# EAGLE design Flat Back Eurorack Busboard (EAGLE 7.2.0)
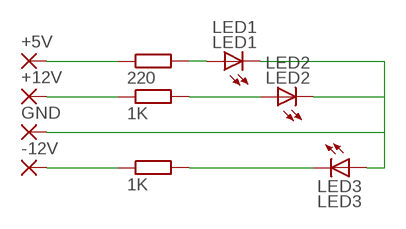
[diagram p0: schematic, sheet 1]

## Parts
+5V  SMD5  [SMD2,54-5,08]
+12V  SMD5  [SMD2,54-5,08]
-12V  SMD5  [SMD2,54-5,08]
GND  SMD5  [SMD2,54-5,08]
LED1  LED1  LEDCHIPLED_0805  [CHIPLED_0805]
LED2  LED2  LEDCHIPLED_0805  [CHIPLED_0805]
LED3  LED3  LEDCHIPLED_0805  [CHIPLED_0805]
R1  220  R-EU_M0805  [M0805]
R2  1K  R-EU_M0805  [M0805]
R3  1K  R-EU_M0805  [M0805]

## Nets
+5V: +5V.1(P) R1.1
+12V: +12V.1(P) R2.1
-12V: -12V.1(P) R3.1
GND: GND.1(P) LED1.C LED2.C LED3.A
N$13: LED1.A R1.2
N$14: LED2.A R2.2
N$15: LED3.C R3.2

## Library data of the parts
+5V +12V -12V GND = wirepad:SMD5: SMD PAD
LED1-LED3 = adafruit:LED: LED OSRAM: - CHIPLED LG R971, LG N971, LY N971, LG Q971, LY Q971, LO R971, LY R971 LH N974, LH R974 LS Q976, LO Q976, LY Q976 LO Q996 - Hyper CHIPLED LW Q18S LB Q993, LB Q99A, LB R99A - SideLED LS A670, LO A670, LY A670, LG A670, LP A670 LB A673, LV A673, LT A673, LW A673 LH A674 LY A675 LS A676, LA A676, LO A676, LY A676, LW A676 LS A679, LY A679, LG A679 - Hyper Micro SIDELED® LS Y876, LA Y876, LO Y876, LY Y876 LT Y87S - SmartLED LW L88C, LW L88S LB L89C, LB L89S, LG L890 LS L89K, LO L89K, LY L89K LS L896, LA L896, LO L896, LY L896 - TOPLED LS T670, LO T670, LY T670, LG T670, LP T670 LSG T670, LSP T670, LSY T670, LOP T670, LYG T670 LG T671, LOG T671, LSG T671 LB T673, LV T673, LT T673, LW T673 LH T674 LS T676, LA T676, LO T676, LY T676, LB T676, LH T676, LSB T676, LW T676 LB T67C, LV T67C, LT T67C, LS T67K, LO T67K, LY T67K, LW E67C LS E67B, LA E67B, LO E67B, LY E67B, LB E67C, LV E67C, LT E67C LW T67C LS T679, LY T679, LG T679 LS T770, LO T770, LY T770, LG T770, LP T770 LB T773, LV T773, LT T773, LW T773 LH T774 LS E675, LA E675, LY E675, LS T675 LS T776, LA T776, LO T776, LY T776, LB T776 LHGB T686 LT T68C, LB T68C - Hyper Mini TOPLED® LB M676 - Mini TOPLED Santana® LG M470 LS M47K, LO M47K, LY M47K Source: http://www.osram.convergy.de/
R1-R3 = resistor:R-EU_: RESISTOR, European symbol

## Board
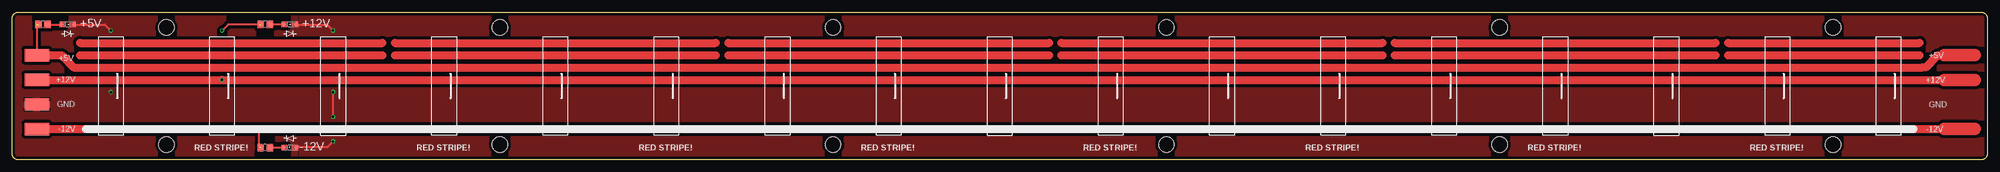
[diagram p1: board, top side]
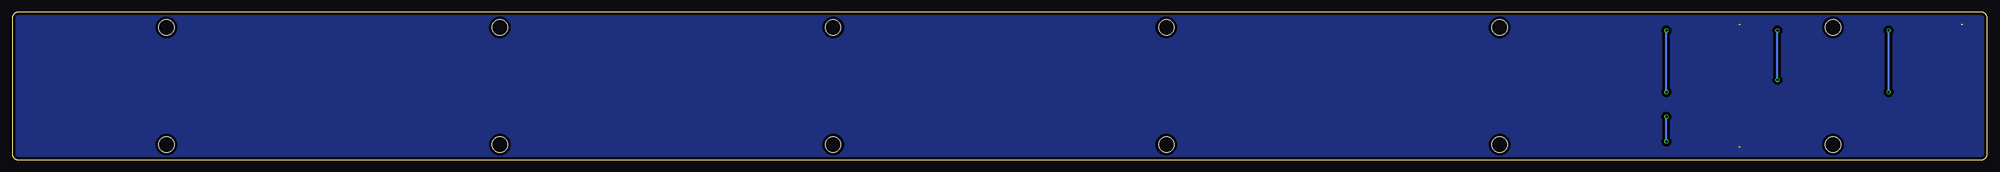
[diagram p2: board, bottom side, seen from below]

Size 406.4 x 30.48 mm. Coordinates in mm from the lower left corner, seen from the top.
Outline: 0,1.27 0,29.21 arc-90 1.27,30.48 405.13,30.48 arc-90 406.4,29.21 406.4,1.27 arc-90 405.13,0 1.27,0 arc-90 0,1.27
Copper layers (1*16): Top 0.035mm / dielectric 1.5mm / Bottom 0.035mm
Design rules "dirt_cheap_dirty_boards.v1": minimum track width 5mil, minimum drill 12mil, track to track 5mil, track to pad 5mil, pad to pad 5mil, via to via 5mil, smd to smd 0mil, copper to edge 10mil, drill to drill 10mil, minimum pad ring 10mil, minimum via ring 6mil, stop-mask expansion 2mil, vias tented up to drill 25mil, thermal gap 10mil
Holes 3.2 mm at 31.75,3.17 31.75,27.3 100.33,3.17 100.33,27.3 168.91,3.17 168.91,27.3 237.49,3.17 237.49,27.3 306.07,3.17 306.07,27.3 374.65,3.17 374.65,27.3

### Footprints (pad centres in the part's own frame; a part is rotated, then mirrored left to right if it is on the bottom)
SMD2,54-5,08 = smd 2.54 x 5.08: 1 0,0
CHIPLED_0805 = smd 1.2 x 1.2: A 0,-1.05; C 0,1.05
M0805 = smd 1.3 x 1.6: 1 -0.95,0; 2 0.95,0

### Placement (x,y rotation side)
+5V  5.08,21.59 90 top
+12V  5.08,16.51 90 top
-12V  5.08,6.35 90 top
GND  5.08,11.43 90 top
LED1  11.43,27.94 270 top
LED2  57.15,27.94 270 top
LED3  57.15,2.54 90 top
R1  6.35,27.94 0 top
R2  52.07,27.94 0 top
R3  52.07,2.54 0 top

### Tracks (layer width: path | path; a pad name or v marks a point on that pad's centre or on a via)
+5V  (1 unrouted)
  Top 0.406: 5.08,27.94 5.08,22.86 +5V.1
  Top 1.676: +5V.1 10.16,21.59 12.7,19.05 393.06,19.05
+12V  (via drill 0.5)  (1 unrouted)
  Top 0.406: 50.8,27.94 44.45,27.94 v43.18,26.67
  Top 1.676: +12V.1 v43.18,16.51 396.88,16.51
  Bottom 0.406: v43.18,16.51 v43.18,26.67
-12V  (1 unrouted)
  Top 0.406: 50.8,2.54 50.8,6.35
  Top 1.676: -12V.1 50.8,6.35 396.56,6.35
GND  (via drill 0.5)
  Top 0.406: v66.04,8.89 v66.04,13.97 | LED3.A 64.77,2.54 v66.04,3.81 | LED2.C 64.77,27.94 v66.04,26.67 | LED1.C 19.05,27.94 v20.32,26.67
  Bottom 0.406: v20.32,13.97 v20.32,26.67 | v66.04,3.81 v66.04,8.89 | v66.04,13.97 v66.04,26.67
  pour Top (isolate 0.61): 0,0 0,30.48 405.13,30.48 405.13,0
N$1
  Top 1.676: 13.97,21.59 76.2,21.59
N$2
  Top 1.676: 78.74,21.59 144.78,21.59
N$3
  Top 1.676: 147.32,21.59 213.36,21.59
N$4
  Top 1.676: 215.9,21.59 281.94,21.59
N$5
  Top 1.676: 284.48,21.59 350.52,21.59
N$6
  Top 1.676: 353.06,21.59 392.43,21.59
N$7
  Top 1.676: 13.97,24.13 76.2,24.13
N$8
  Top 1.676: 78.74,24.13 144.78,24.13
N$9
  Top 1.676: 147.32,24.13 213.36,24.13
N$10
  Top 1.676: 215.9,24.13 281.94,24.13
N$11
  Top 1.676: 284.48,24.13 350.52,24.13
N$12
  Top 1.676: 353.06,24.13 392.43,24.13
N$13
  Top 0.406: R1.2 LED1.A
N$14
  Top 0.406: LED2.A R2.2
N$15
  Top 0.406: R3.2 LED3.C
N$16
  pour Bottom (isolate 0.61): 0,0 0,30.48 405.13,30.48 406.4,29.21 406.4,0
N$19
  Top 1.676: 393.7,19.05 396.24,21.59 397.51,21.59
  Top 2.54: 397.51,21.59 403.86,21.59
N$20
  Top 2.54: 397.51,16.51 403.86,16.51
N$21
  Top 2.54: 397.51,6.35 403.86,6.35

### Text on the board
tPlace: +5V | +12V | GND | -12V | RED STRIPE! | RED STRIPE! | RED STRIPE! | RED STRIPE! | RED STRIPE! | RED STRIPE! | RED STRIPE! | RED STRIPE!
tNames: +5V | +12V | -12V